# Altium schematic sheet Key-Matrix.SchDoc
size 381 x 279 mm
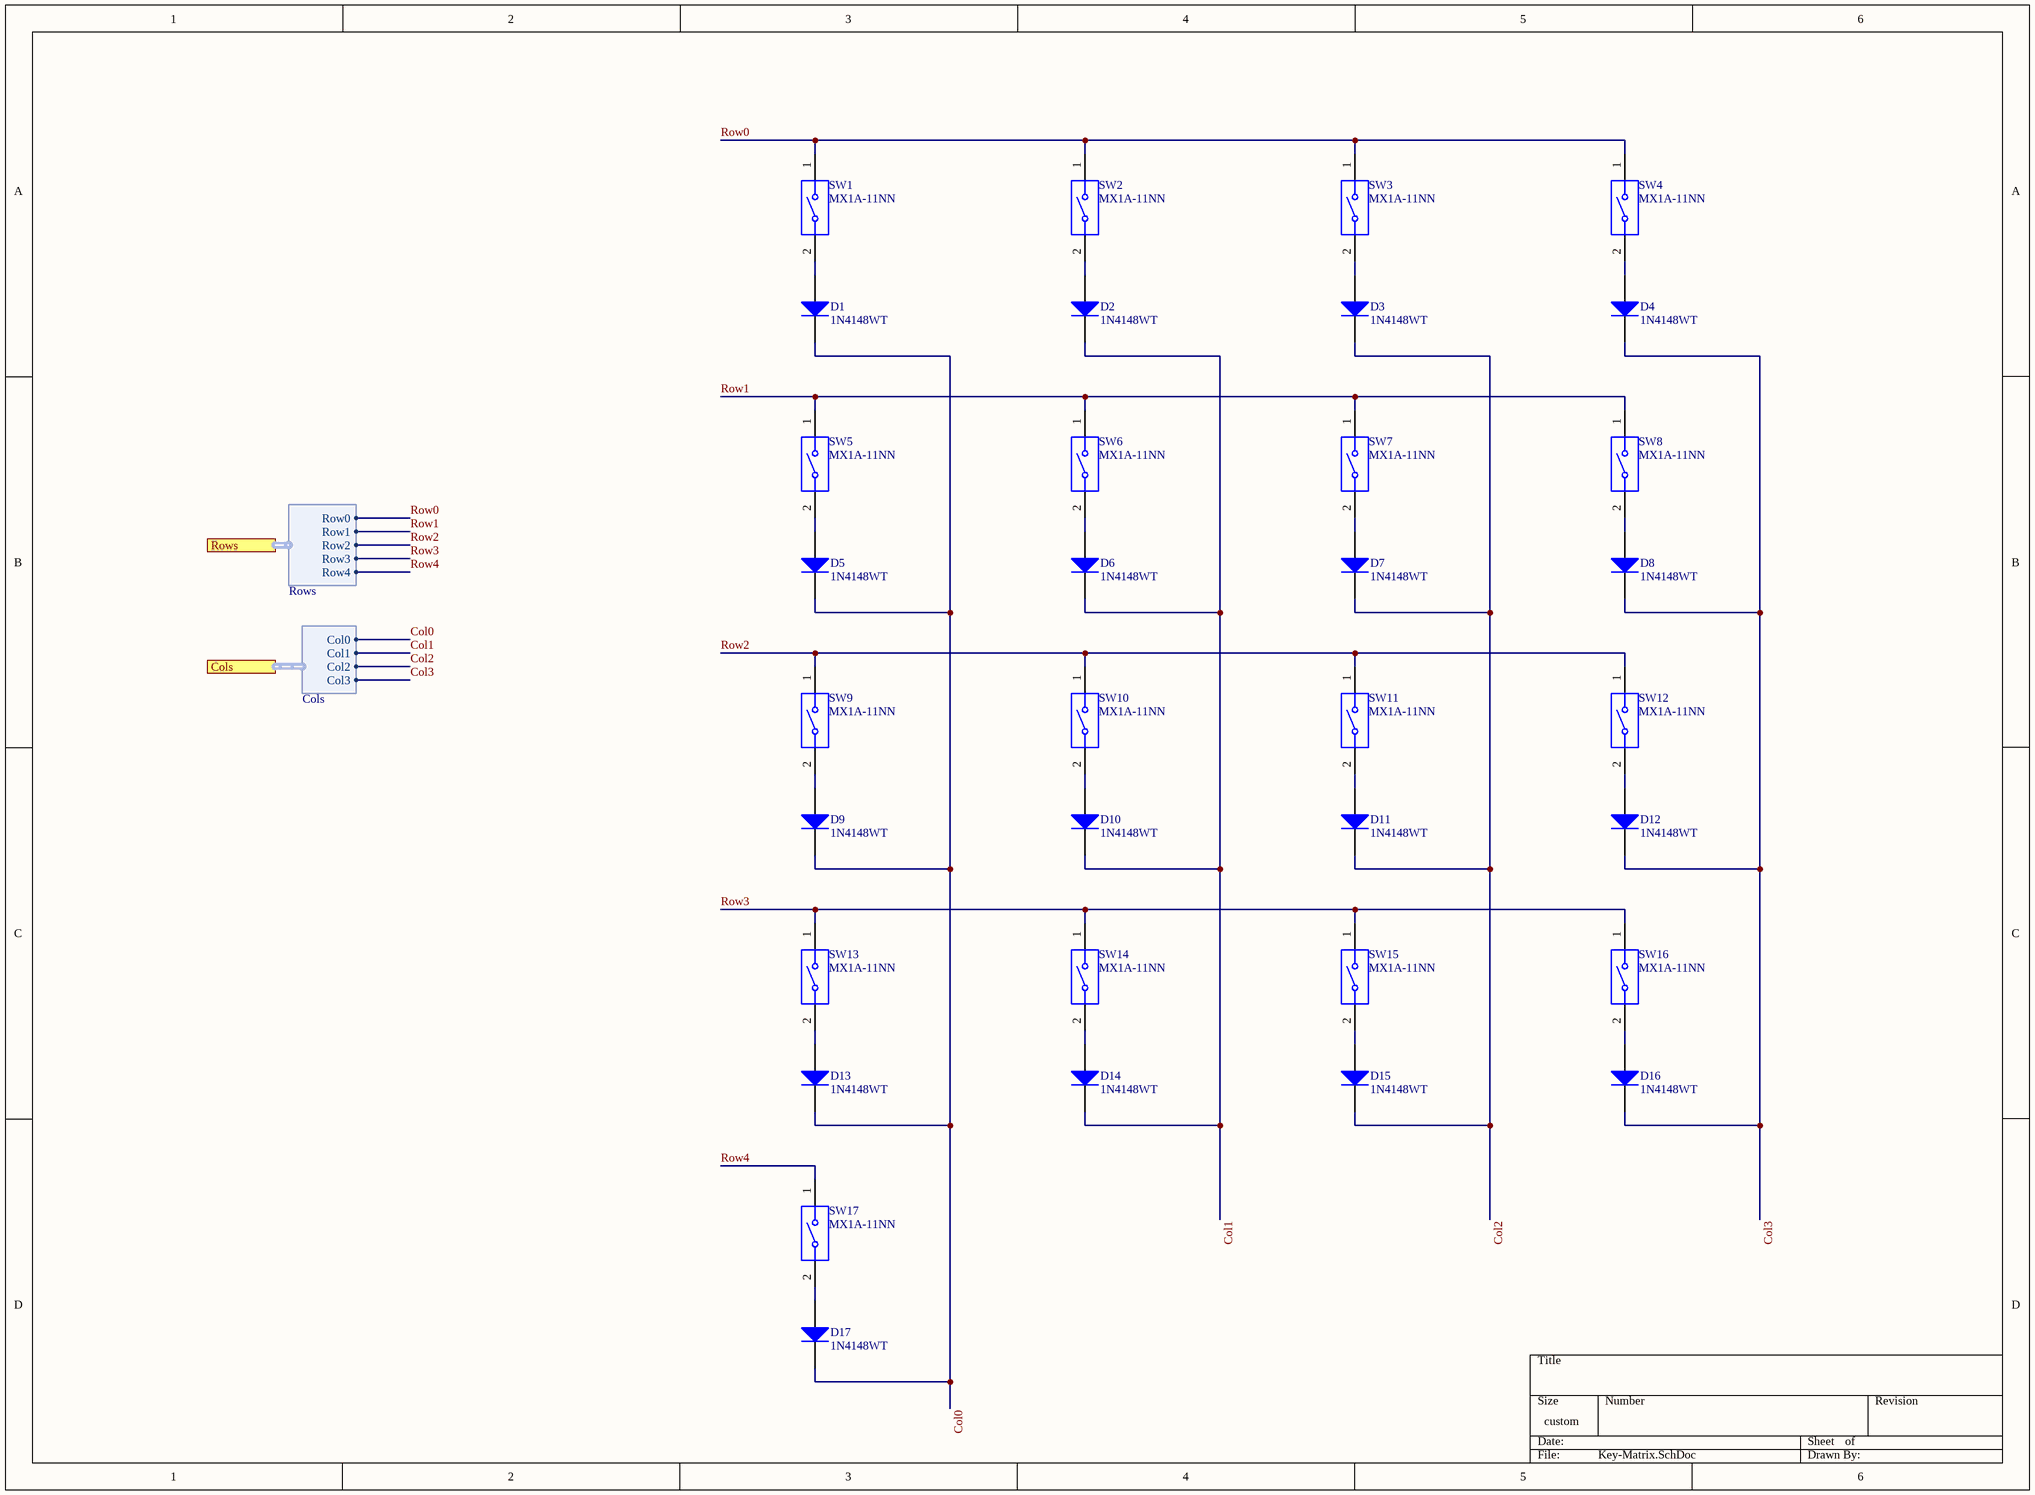
[diagram p0: Key-Matrix.SchDoc]

## Parts
D1  1N4148WT  [FAIR-SOD-523F-2_V]
D2  1N4148WT  [FAIR-SOD-523F-2_V]
D3  1N4148WT  [FAIR-SOD-523F-2_V]
D4  1N4148WT  [FAIR-SOD-523F-2_V]
D5  1N4148WT  [FAIR-SOD-523F-2_V]
D6  1N4148WT  [FAIR-SOD-523F-2_V]
D7  1N4148WT  [FAIR-SOD-523F-2_V]
D8  1N4148WT  [FAIR-SOD-523F-2_V]
D9  1N4148WT  [FAIR-SOD-523F-2_V]
D10  1N4148WT  [FAIR-SOD-523F-2_V]
D11  1N4148WT  [FAIR-SOD-523F-2_V]
D12  1N4148WT  [FAIR-SOD-523F-2_V]
D13  1N4148WT  [FAIR-SOD-523F-2_V]
D14  1N4148WT  [FAIR-SOD-523F-2_V]
D15  1N4148WT  [FAIR-SOD-523F-2_V]
D16  1N4148WT  [FAIR-SOD-523F-2_V]
D17  1N4148WT  [FAIR-SOD-523F-2_V]
SW1  MX1A-11NN  [CHRY-MX1A-11NN_V]
SW2  MX1A-11NN  [CHRY-MX1A-11NN_V]
SW3  MX1A-11NN  [CHRY-MX1A-11NN_V]
SW4  MX1A-11NN  [CHRY-MX1A-11NN_V]
SW5  MX1A-11NN  [CHRY-MX1A-11NN_V]
SW6  MX1A-11NN  [CHRY-MX1A-11NN_V]
SW7  MX1A-11NN  [CHRY-MX1A-11NN_V]
SW8  MX1A-11NN  [CHRY-MX1A-11NN_V]
SW9  MX1A-11NN  [CHRY-MX1A-11NN_V]
SW10  MX1A-11NN  [CHRY-MX1A-11NN_V]
SW11  MX1A-11NN  [CHRY-MX1A-11NN_V]
SW12  MX1A-11NN  [CHRY-MX1A-11NN_V]
SW13  MX1A-11NN  [CHRY-MX1A-11NN_V]
SW14  MX1A-11NN  [CHRY-MX1A-11NN_V]
SW15  MX1A-11NN  [CHRY-MX1A-11NN_V]
SW16  MX1A-11NN  [CHRY-MX1A-11NN_V]
SW17  MX1A-11NN  [CHRY-MX1A-11NN_V]

## Ports
Cols (harness Cols), Rows (harness Rows)

## Harnesses
Rows: Row0, Row1, Row2, Row3, Row4
Cols: Col0, Col1, Col2, Col3

## Nets
Col0: D1.1(K) D5.1(K) D9.1(K) D13.1(K) D17.1(K) ; port Cols.Col0
Col1: D2.1(K) D6.1(K) D10.1(K) D14.1(K) ; port Cols.Col1
Col2: D3.1(K) D7.1(K) D11.1(K) D15.1(K) ; port Cols.Col2
Col3: D4.1(K) D8.1(K) D12.1(K) D16.1(K) ; port Cols.Col3
Row0: SW1.1 SW2.1 SW3.1 SW4.1 ; port Rows.Row0
Row1: SW5.1 SW6.1 SW7.1 SW8.1 ; port Rows.Row1
Row2: SW9.1 SW10.1 SW11.1 SW12.1 ; port Rows.Row2
Row3: SW13.1 SW14.1 SW15.1 SW16.1 ; port Rows.Row3
Row4: SW17.1 ; port Rows.Row4
NetD1_2: D1.2(A) SW1.2
NetD2_2: D2.2(A) SW2.2
NetD3_2: D3.2(A) SW3.2
NetD4_2: D4.2(A) SW4.2
NetD5_2: D5.2(A) SW5.2
NetD6_2: D6.2(A) SW6.2
NetD7_2: D7.2(A) SW7.2
NetD8_2: D8.2(A) SW8.2
NetD9_2: D9.2(A) SW9.2
NetD10_2: D10.2(A) SW10.2
NetD11_2: D11.2(A) SW11.2
NetD12_2: D12.2(A) SW12.2
NetD13_2: D13.2(A) SW13.2
NetD14_2: D14.2(A) SW14.2
NetD15_2: D15.2(A) SW15.2
NetD16_2: D16.2(A) SW16.2
NetD17_2: D17.2(A) SW17.2

## Library data of the parts
D1-D17 = CMP-0881-00001-1: High Conductance Fast Switching Diode, 75 V, -55 to 150 degC, 2-Pin SOD523F, RoHS; Manufacturer: Fairchild Semiconductor; IR (VR: 75 V)=5 uA Max.; VF: 1 V Max.; BVR (IR: 5 uA)=75 V Min.; CO: 4 pF Max.; DatasheetVersion: Rev. A2; ComponentLink1Description: Manufacturer URL; PackageDescription: 2-Pin Surface Mount Device, Body 1.2 x 0.8 mm, Height 0.7 mm; ComponentLink2URL: http://www.fairchildsemi.com/ds/1N/1N4148WT.pdf; ComponentLink2Description: Datasheet; PartNumber: 1N4148WT; ComponentLink1URL: http://www.fairchildsemi.com/; Temperature Range: -55 to 150 degC; Mounting Technology: Surface Mount; PackageReference: SOD-523F-2; RoHS: TRUE
SW1-SW17 = CMP-2000-06785-1: Keymodule MX, SPST, IP40, 12 V Max, 10 mA Max, -10 to 70 degC, 2-Pin THD, RoHS, Bulk; Part No: MX1A11NN; Manufacturer: Cherry; Body Orientation: Straight; Total Travel: 4.06mm; Actuator Style: Button; Minimum Insulation Resistance: 100MOhm; Maximum Current Rating: 0.01A; Maximum Contact Resistance: 200mOhm; Operating Force: 0.58N; Actuator Length: 3.6mm; Maximum DC Voltage Rating: 12V; Illumination Type: N/R; Row Spacing: 6.35mm; Switch Configuration: N.O.; Electrical Life: 50000000Cycles; Type: DesktopProfile; Operating Temperature: -10to70C; Actuator Material: N/A; Supplier: CherryElectrical; Packaging: N/A; Contact Plating: N/A; Terminal Type: PCPins; Mechanical Life: N/A; Package Description: 2-Pin Through Hole Switch, Body 15.6 x 15.6 mm; Package Reference: MX1A-11NN; ECCN: EAR99; RoHS: Unknown; Contact Material: Silver/Gold; Datasheet URL: http://www.cherry.de/PDF/EN_CHERRY_MX1A-1xxx.pdf; Datasheet Version: 02/2016; Family: MX; Number of Terminals: 2; IP Rating: N/A; Pole Throw Configuration: SPST; Terminal Pitch: 2.54mm; Dielectric Strength: N/A; Actuator Color: N/A; Manufacturer URL: http://cherryswitches.com/cn/; HTS: 8536509065; Maximum Power Rating: N/A; Illumination Color: N/R; Dimension: 15.6x15.6x15.2mm; Housing Material: N/A; Maximum AC Voltage Rating: 12V; Package URL: http://cherryamericas.com/wp-content/uploads/2014/12/mx_cat.pdf; Mounting Technology: ThroughHole; Mounting: ThroughHole; Operating Speed: N/A